# Altium schematic sheet PowerSequence.SchDoc: =TITLE
size A3; DocumentNumber: 7; SheetNumber: 7; SheetTotal: 11
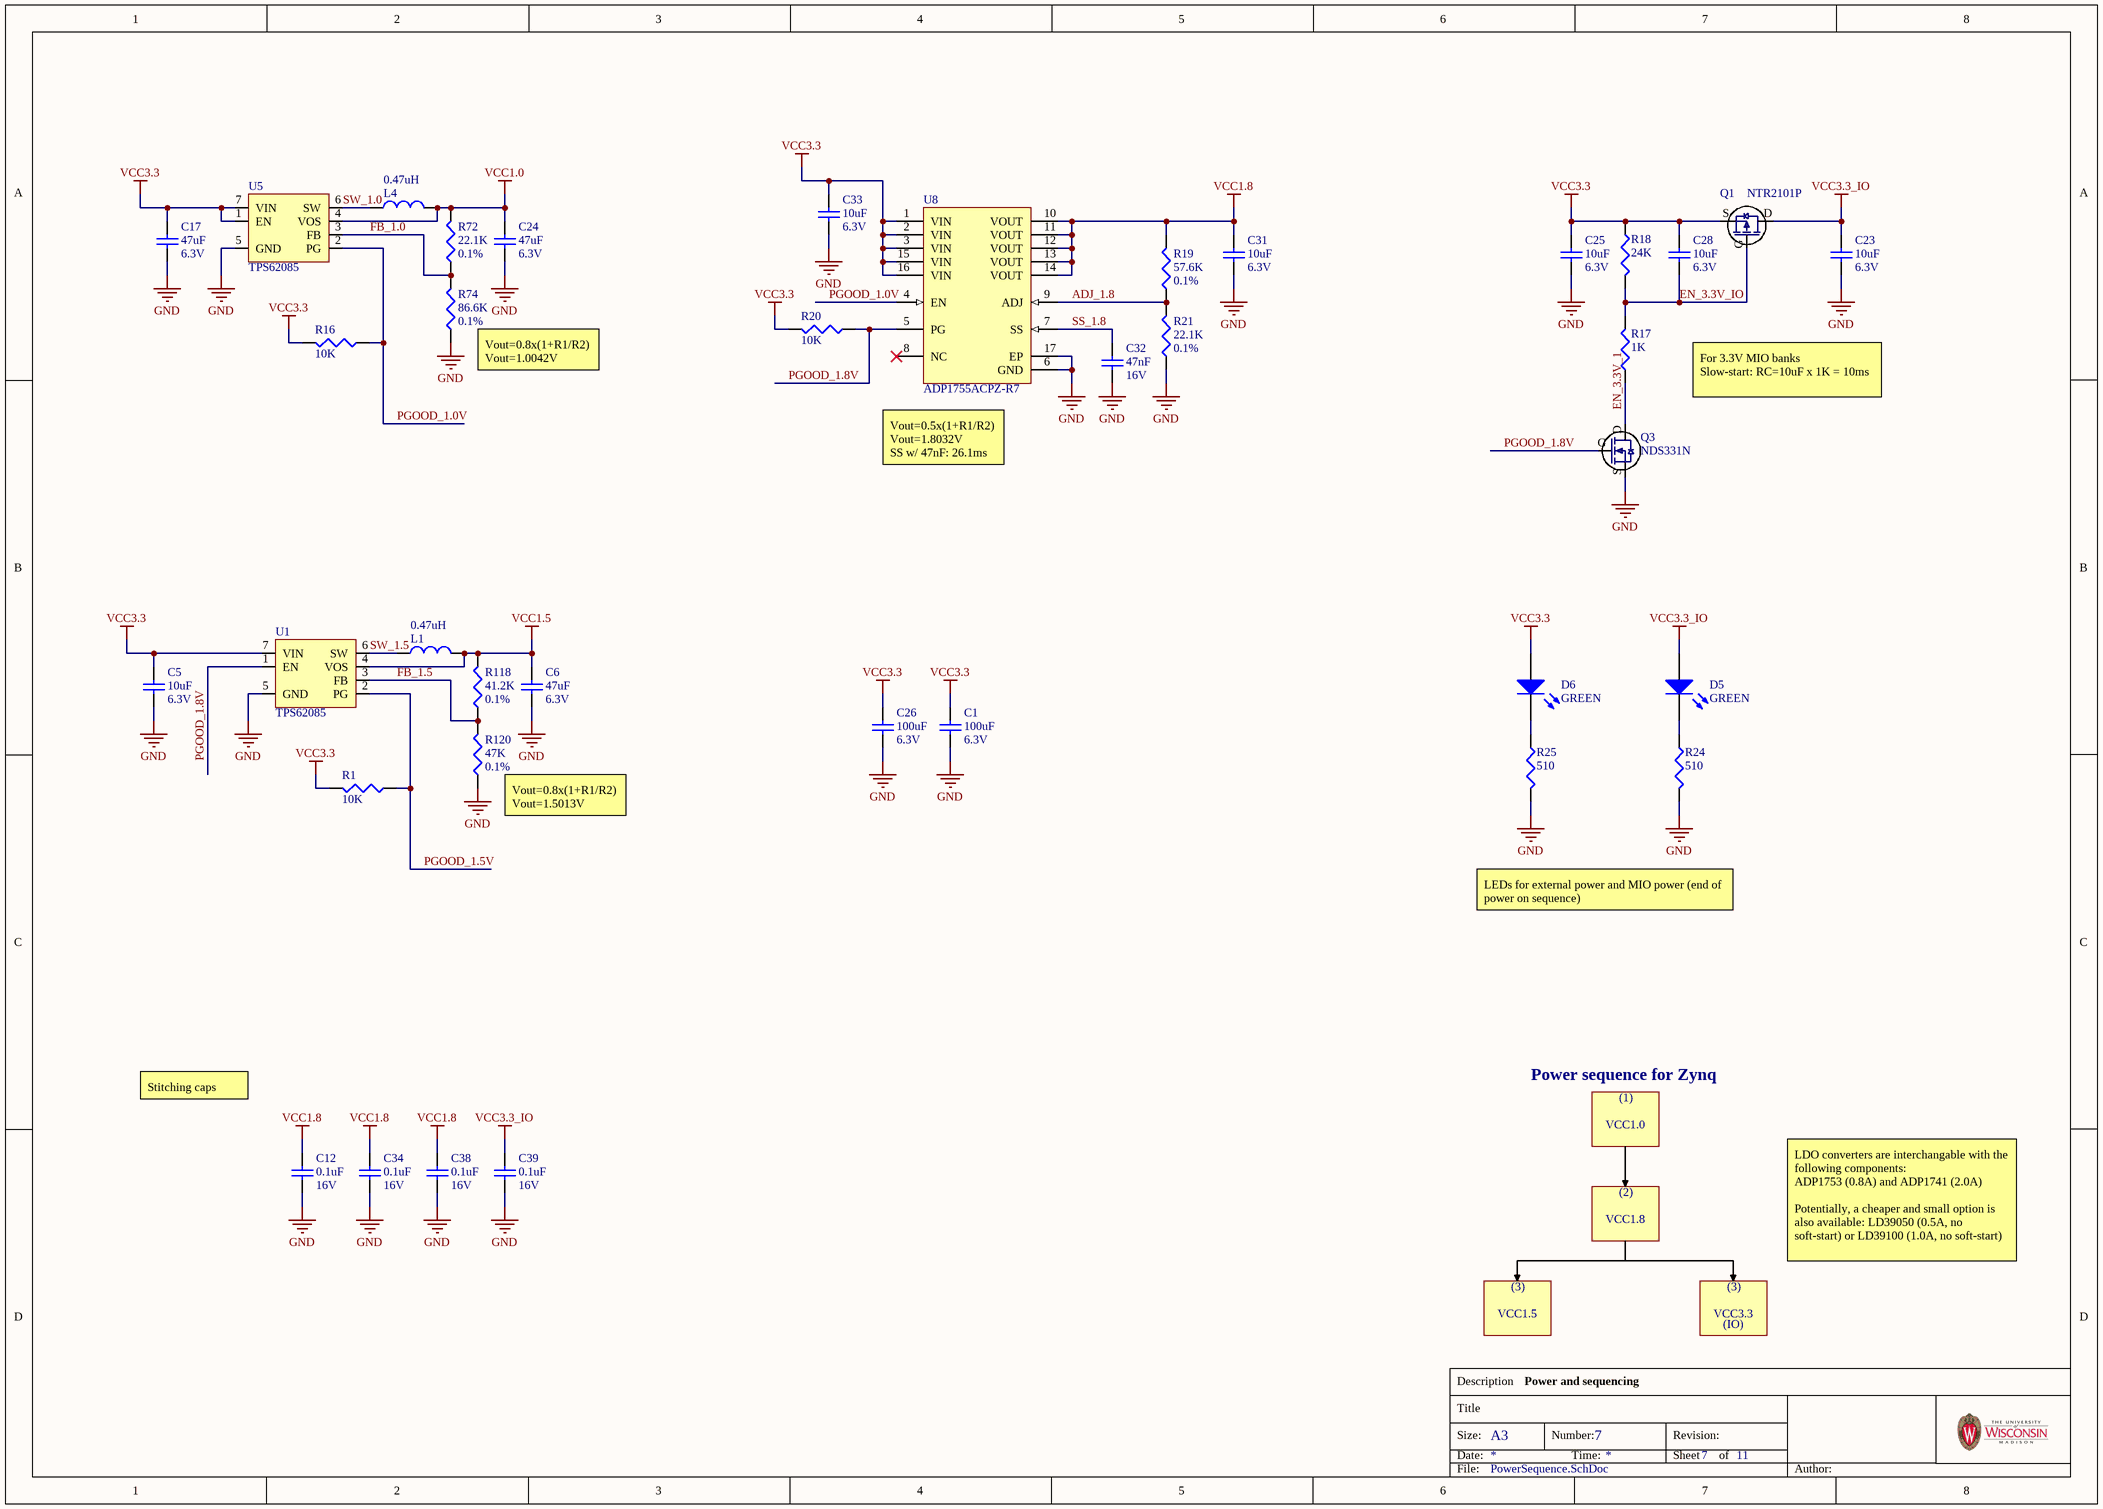
[diagram p0: PowerSequence.SchDoc]

## Parts
C1  value 100uF  Rating: 6.3V  [C1210_IPC_H]  (hidden comment: ?)
C5  value 10uF  Rating: 6.3V  [C0402_IPC_H]  (hidden comment: ?)
C6  value 47uF  Rating: 6.3V  [C0805_M]  (hidden comment: ?)
C12  value 0.1uF  Rating: 16V  [C0402_IPC_H]  (hidden comment: ?)
C17  value 47uF  Rating: 6.3V  [C0805_M]  (hidden comment: ?)
C23  value 10uF  Rating: 6.3V  [C0402_IPC_H]  (hidden comment: ?)
C24  value 47uF  Rating: 6.3V  [C0805_M]  (hidden comment: ?)
C25  value 10uF  Rating: 6.3V  [C0402_IPC_H]  (hidden comment: ?)
C26  value 100uF  Rating: 6.3V  [C1210_IPC_H]  (hidden comment: ?)
C28  value 10uF  Rating: 6.3V  [C0402_IPC_H]  (hidden comment: ?)
C31  value 10uF  Rating: 6.3V  [C0402_IPC_H]  (hidden comment: ?)
C32  value 47nF  Rating: 16V  [C0402_IPC_H]  (hidden comment: ?)
C33  value 10uF  Rating: 6.3V  [C0402_IPC_H]  (hidden comment: ?)
C34  value 0.1uF  Rating: 16V  [C0402_IPC_H]  (hidden comment: ?)
C38  value 0.1uF  Rating: 16V  [C0402_IPC_H]  (hidden comment: ?)
C39  value 0.1uF  Rating: 16V  [C0402_IPC_H]  (hidden comment: ?)
D5  value GREEN  [LED0603_M]  (hidden comment: ?)
D6  value GREEN  [LED0603_M]  (hidden comment: ?)
L1  value 0.47uH  [L2520_H]  (hidden comment: DFE252012F-R47M=P2)
L4  value 0.47uH  [L2520_H]  (hidden comment: DFE252012F-R47M=P2)
Q1  NTR2101P  [SOT23-H]
Q3  NDS331N  [SOT23-H]
R1  value 10K  [R0201_IPC_H]  (hidden comment: ?)
R16  value 10K  [R0201_IPC_H]  (hidden comment: ?)
R17  value 1K  [R0402_IPC_H]  (hidden comment: ?)
R18  value 24K  [R0402_IPC_H]  (hidden comment: ?)
R19  value 57.6K  Tolerance: 0.1%  [R0402_IPC_H]  (hidden comment: ?)
R20  value 10K  [R0201_IPC_H]  (hidden comment: ?)
R21  value 22.1K  Tolerance: 0.1%  [R0402_IPC_H]  (hidden comment: ?)
R24  value 510  [R0402_IPC_H]  (hidden comment: ?)
R25  value 510  [R0402_IPC_H]  (hidden comment: ?)
R72  value 22.1K  Tolerance: 0.1%  [R0402_IPC_H]  (hidden comment: ?)
R74  value 86.6K  Tolerance: 0.1%  [R0402_IPC_H]  (hidden comment: ?)
R118  value 41.2K  Tolerance: 0.1%  [R0402_IPC_H]  (hidden comment: ?)
R120  value 47K  Tolerance: 0.1%  [R0402_IPC_H]  (hidden comment: ?)
U1  TPS62085  [VSON-8_L]
U5  TPS62085  [VSON-8_L]
U8  ADP1755ACPZ-R7  [CP-16-4_L]

## Nets
GND: C1.2 C5.2 C6.1 C12.2 C17.2 C23.2 C24.1 C25.2 C26.2 C31.1 C32.2 C33.2 C34.2 C38.2 C39.2 Q3.S R21.1 R24.2 R25.2 R74.1 R120.1 U1.5(GND) U5.5(GND) U8.6(GND) U8.17(EP)
VCC1.0: C24.2 L4.2 R72.2 U5.4(VOS)
VCC1.5: C6.2 L1.2 R118.2 U1.4(VOS)
VCC1.8: C12.1 C31.2 C34.1 C38.1 R19.2 U8.10(VOUT) U8.11(VOUT) U8.12(VOUT) U8.13(VOUT) U8.14(VOUT)
VCC3.3: C1.1 C5.1 C17.1 C25.1 C26.1 C28.1 C33.1 D6.1(A) Q1.S R1.2 R16.2 R18.1 R20.2 U1.7(VIN) U5.1(EN) U5.7(VIN) U8.1(VIN) U8.2(VIN) U8.3(VIN) U8.15(VIN) U8.16(VIN)
VCC3.3_IO: C23.1 C39.1 D5.1(A) Q1.D
ADJ_1.8: R19.1 R21.2 U8.9(ADJ)
EN_3.3V_1: Q3.D R17.1
EN_3.3V_IO: C28.2 Q1.G R17.2 R18.2
FB_1.0: R72.1 R74.2 U5.3(FB)
FB_1.5: R118.1 R120.2 U1.3(FB)
PGOOD_1.0V: R16.1 U5.2(PG) U8.4(EN)
PGOOD_1.5V: R1.1 U1.2(PG)
PGOOD_1.8V: Q3.G R20.1 U1.1(EN) U8.5(PG)
SS_1.8: C32.1 U8.7(SS)
SW_1.0: L4.1 U5.6(SW)
SW_1.5: L1.1 U1.6(SW)
NetD5_2: D5.2(K) R24.1
NetD6_2: D6.2(K) R25.1

Not connected (* = marked no-connect by the designer): U8 8(NC)*

## Notes on the sheet
- (near R74) Vout=0.8x(1+R1/R2)
  Vout=1.0042V
- For 3.3V MIO banks
  Slow-start: RC=10uF x 1K = 10ms
- (near U8) Vout=0.5x(1+R1/R2)
  Vout=1.8032V
  SS w/ 47nF: 26.1ms
- (near R120) Vout=0.8x(1+R1/R2)
  Vout=1.5013V
- LEDs for external power and MIO power (end of power on sequence)
- Stitching caps
- Power sequence for Zynq
- VCC1.0
- (1)
- VCC1.8
- (2)
- LDO converters are interchangable with the following components:
  ADP1753 (0.8A) and ADP1741 (2.0A)
  Potentially, a cheaper and small option is also available: LD39050 (0.5A, no soft-start) or LD39100 (1.0A, no soft-start)
- VCC1.5
- (3)
- VCC3.3
- (IO)
- Power and sequencing
- Description
- Title
- Size:
- Date:
- A3
- Number:
- Time:
- Revision:
- Sheet
- of
- File:
- Author:

## Library data of the parts
C1 C26 = Cap: Capacitor; Part: GRM32ER60J107ME20L; Manufacturer: Murata; INVKEY: CP1210-100UF-6.3V-20%; PackageDescription: Chip Capacitor
C5 C23 C25 C28 C31 C33 = Cap: Capacitor; Manufacturer: Murata; Part: GRM155R60J106ME44D; INVKEY: CP0402-10UF-6V3-20%; PackageDescription: Chip Capacitor
C6 C17 C24 = Cap: Capacitor; Manufacturer: TDK; Part: C2012X5R0J476M125AC; INVKEY: CP0805-47UF-6.3V; PackageDescription: Chip Capacitor
C12 C34 C38 C39 = Cap: Capacitor; Manufacturer: Murata; Part: GRM155R71C104KA88D; INVKEY: CP0402-0.1UF-16V-10%; PackageDescription: Chip Capacitor
C32 = Cap: Capacitor; Part: GRM155R71C473KA01D; Manufacturer: Murata; INVKEY: CP0402-47nf-16V-10%; PackageDescription: Chip Capacitor
D5 D6 = LED: Light Emitting Diode; Manufacturer: Lite-On; Part: LTST-C190KGKT; INVKEY: LED-GN-TOP-0603
L1 L4 = Ind: Inductor; Manufacturer: Murata; Tolerance: 20%; DC Resistance: 23mOhm; DC Current: 6.7A; INVKEY: IND-DFE2520102F; PackageDescription: Chip Inductor; Part: DFE252012F-R47M=P2
Q1 = NTR2101P: Small Signal MOSFET, −8.0V, −3.7 A, Single P−Channel, SOT−23; pin to pad: D>3 G>1 S>2; Manufacturer: On Semiconductor; INVKEY: MOS-NTR2101P-SOT23; Part: NTR2101P
Q3 = NDS331N: N-Channel   Logic Level Enhancement Mode Field Effect Transistor; pin to pad: D>3 G>1 S>2; Manufacturer: Fairchild; INVKEY: FET-NDS331N-SSOT23; Part: NDS331N
R1 R16 R20 = Res: Resistor; Manufacturer: Panasonic; Part: ERJ-1GNF1002C; Tolerance: 1%; INVKEY: RS0201-10K-1/20W-1%; PackageDescription: Chip Resistor
R17 = Res: Resistor; Manufacturer: Panasonic-ECG; Part: ERJ-2RKF1001X; Tolerance: 1%; INVKEY: RS0402-1K-1/10W-1%; PackageDescription: Chip Resistor
R18 = Res: Resistor; Manufacturer: Panasonic; Part: ERJ-2RKF2402X; Tolerance: 1%; INVKEY: RS0402-24K-1/10W-1%; PackageDescription: Chip Resistor
R19 = Res: Resistor; Manufacturer: Panasonic; Part: ERA-2AEB5762X; INVKEY: R0402-57K6-1/16W-PREC; PackageDescription: Chip Resistor
R21 R72 = Res: Resistor; Manufacturer: Panasonic; Part: ERA-2AEB2212X; INVKEY: RS0402-22K1-1/16W-PREC; PackageDescription: Chip Resistor
R24 R25 = Res: Resistor; Manufacturer: Panasonic-ECG; Part: ERJ-2RKF5100X; Tolerance: 1%; INVKEY: RS0402-510R-1/10W-1%; PackageDescription: Chip Resistor
R74 = Res: Resistor; Manufacturer: Panasonic-ECG; Part: ERA-2AEB8662X; INVKEY: RS0402-86K6-1/16W-PREC; PackageDescription: Chip Resistor
R118 = Res: Resistor; Manufacturer: Panasonic; Part: ERA-2AEB4122X; INVKEY: RS0402-41K2-1/16W-PREC; PackageDescription: Chip Resistor
R120 = Res: Resistor; Manufacturer: Panasonic; Part: ERA-2AEB473X; INVKEY: RS0402-47K-1/16W-PREC; PackageDescription: Chip Resistor
U1 U5 = TPS62085: 3-A Step-Down Converter With Hiccup Short-Circuit Protection; Manufacturer: Texas Instruments; INVKEY: IC-TPS62085; Part: TPS62085
U8 = CMP-0786-00436-1: 1.2 A, Low VIN, Low Dropout Linear Regulator, 1.6 to 3.6 V Vin, 0.75 to 3 V Vout, Industrial, 16-pin QFN (CP-16-4), Reel; Manufacturer: Analog; Vin (min) (V): 1.6; Vin (max) (V): 3.6; Vout Adjustable Range: 0.75V to 3.3V; Iout max: 1.2A; Supply Current IGND @ Small Load: 90uA; INVKEY: IC-REG-ADP1755ACPZ; PackageVersion: 010606-0, 01/2006; ComponentLink3URL: http://www.analog.com/static/imported-files/packages/46009454504174339653421710019CP_16_4.pdf; ComponentLink4URL: Product URL:http://www.analog.com/en/ADP1755/productSearch.html; ComponentLink1Description: Manufacturer URL; Packing: Reel; PackageDescription: 16-Pin Lead Frame Chip Scale Package, Body 4 x 4 mm, Pitch 0.65 mm; ComponentLink2URL: http://www.analog.com/static/imported-files/data_sheets/ADP1754_1755.pdf; PackageReference: CP-16-4; DatasheetVersion: Rev. D; ComponentLink4Description: URL Link1; Code_JEDEC: MO-220-VGGC; PartNumber: ADP1755ACPZ-R7; ComponentLink3Description: Package Specification; Mounting Technology: Surface Mount; ComponentLink1URL: http://www.analog.com/en/index.html; ComponentLink2Description: Datasheet; Part: ADP1755ACPZ-R7